# EAGLE design MyoWare_Proto_Shield (EAGLE 7.3.2)
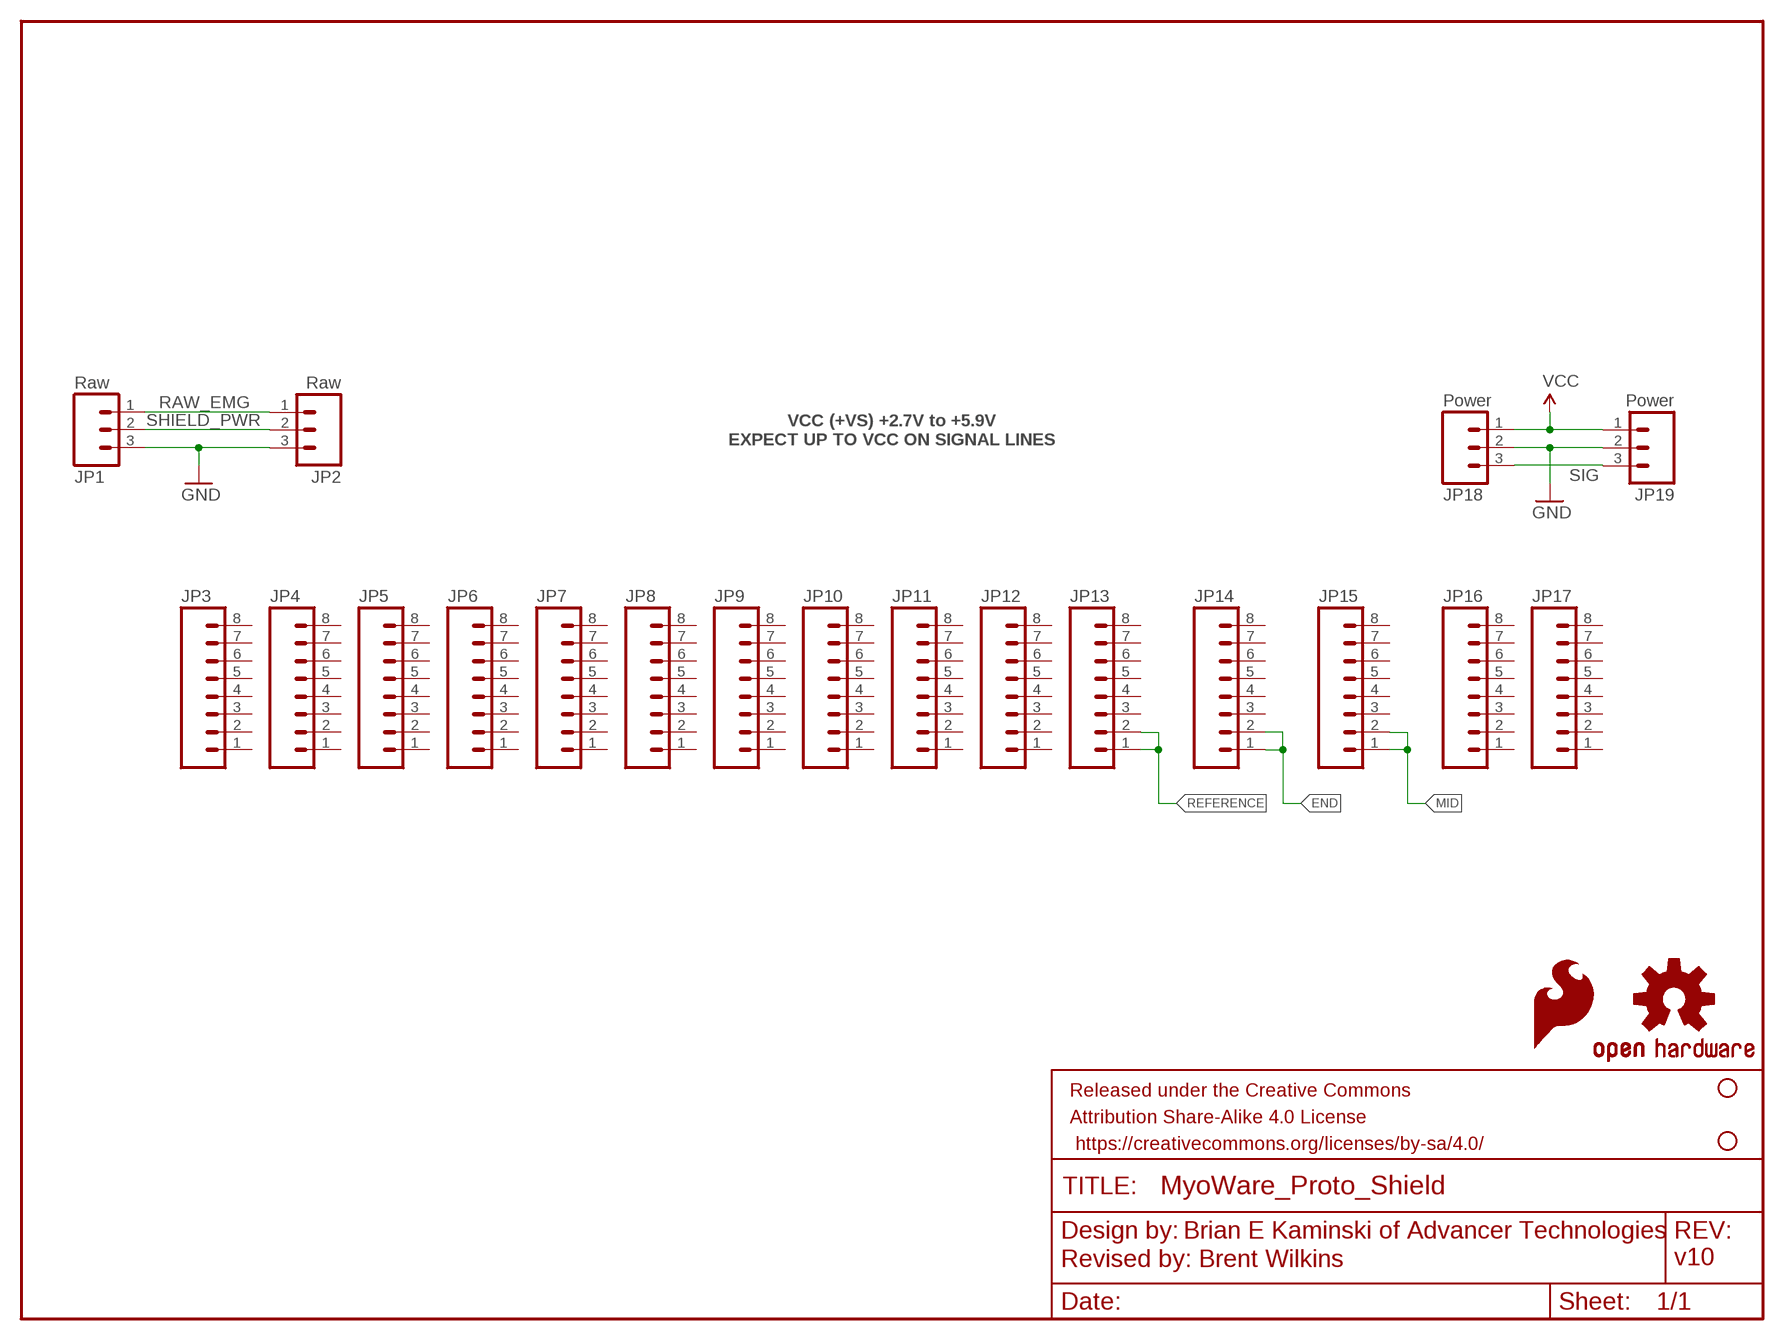
[diagram p0: schematic, sheet 1]

## Parts
FRAME1  FRAME-LETTER  [CREATIVE_COMMONS]
JP1  Raw  M031X03_NO_SILK  [1X03_NO_SILK]
JP2  Raw  M031X03_NO_SILK  [1X03_NO_SILK]
JP3  M08NO_SILK  [1X08_NO_SILK]
JP4  M08NO_SILK  [1X08_NO_SILK]
JP5  M08NO_SILK  [1X08_NO_SILK]
JP6  M08NO_SILK  [1X08_NO_SILK]
JP7  M08NO_SILK  [1X08_NO_SILK]
JP8  M08NO_SILK  [1X08_NO_SILK]
JP9  M08NO_SILK  [1X08_NO_SILK]
JP10  M08NO_SILK  [1X08_NO_SILK]
JP11  M08NO_SILK  [1X08_NO_SILK]
JP12  M08NO_SILK  [1X08_NO_SILK]
JP13  M08NO_SILK  [1X08_NO_SILK]
JP14  M08NO_SILK  [1X08_NO_SILK]
JP15  M08NO_SILK  [1X08_NO_SILK]
JP16  M08NO_SILK  [1X08_NO_SILK]
JP17  M08NO_SILK  [1X08_NO_SILK]
JP18  Power  M031X03_NO_SILK  [1X03_NO_SILK]
JP19  Power  M031X03_NO_SILK  [1X03_NO_SILK]
JP20  STAND-OFF  [STAND-OFF]
JP21  STAND-OFF  [STAND-OFF]
LOGO1  SFE_LOGO_FLAME.1_INCH  [SFE_LOGO_FLAME_.1]
LOGO2  OSHW-LOGOS  [OSHW-LOGO-S]

## Nets
END: JP14.1 JP14.2
GND: JP1.3 JP2.3 JP18.2 JP19.2
MID: JP15.1 JP15.2
RAW_EMG: JP1.1 JP2.1
REFERENCE: JP13.1 JP13.2
SHIELD_PWR: JP1.2 JP2.2
SIG: JP18.3 JP19.3
VCC: JP18.1 JP19.1
Unconnected: JP3.1 JP3.2 JP3.3 JP3.4 JP3.5 JP3.6 JP3.7 JP3.8 JP4.1 JP4.2 JP4.3 JP4.4 JP4.5 JP4.6 JP4.7 JP4.8 JP5.1 JP5.2 JP5.3 JP5.4 JP5.5 JP5.6 JP5.7 JP5.8 JP6.1 JP6.2 JP6.3 JP6.4 JP6.5 JP6.6 JP6.7 JP6.8 JP7.1 JP7.2 JP7.3 JP7.4 JP7.5 JP7.6 JP7.7 JP7.8 JP8.1 JP8.2 JP8.3 JP8.4 JP8.5 JP8.6 JP8.7 JP8.8 JP9.1 JP9.2 JP9.3 JP9.4 JP9.5 JP9.6 JP9.7 JP9.8 JP10.1 JP10.2 JP10.3 JP10.4 JP10.5 JP10.6 JP10.7 JP10.8 JP11.1 JP11.2 JP11.3 JP11.4 JP11.5 JP11.6 JP11.7 JP11.8 JP12.1 JP12.2 JP12.3 JP12.4 JP12.5 JP12.6 JP12.7 JP12.8 JP13.3 JP13.4 JP13.5 JP13.6 JP13.7 JP13.8 JP14.3 JP14.4 JP14.5 JP14.6 JP14.7 JP14.8 JP15.3 JP15.4 JP15.5 JP15.6 JP15.7 JP15.8 JP16.1 JP16.2 JP16.3 JP16.4 JP16.5 JP16.6 JP16.7 JP16.8 JP17.1 JP17.2 JP17.3 JP17.4 JP17.5 JP17.6 JP17.7 JP17.8

## Notes on the sheet
- VCC (+VS) +2.7V to +5.9V
  EXPECT UP TO VCC ON SIGNAL LINES
- Brian E Kaminski of Advancer Technologies
- Revised by: Brent Wilkins | v10

## Library data of the parts
FRAME1 = SparkFun-Aesthetics:FRAME-LETTER: Schematic Frame Standard 8.5x11 US Letter frame
JP1 JP2 JP18 JP19 = SparkFun-Connectors:M03: Header 3 Standard 3-pin 0.1" header. Use with straight break away headers (SKU : PRT-00116), right angle break away headers (PRT-00553), swiss pins (PRT-00743), machine pins (PRT-00117), and female headers (PRT-00115). Molex polarized connector foot print use with SKU : PRT-08232 with associated crimp pins and housings.
JP3-JP17 = SparkFun-Connectors:M08: Header 8 Standard 8-pin 0.1" header. Use with straight break away headers (SKU : PRT-00116), right angle break away headers (PRT-00553), swiss pins (PRT-00743), machine pins (PRT-00117), and female headers (PRT-00115).
JP20 JP21 = SparkFun-Electromechanical:STAND-OFF: #4 Stand Off This is the mechanical footprint for a #4 phillips button head screw. Use the keepout ring to avoid running the screw head into surrounding components. SKU : PRT-00447
LOGO1 = SparkFun-Aesthetics:SFE_LOGO_FLAME: SFE Logo, flame only This is the SparkFun flame logo. The logo on the schematic will always be the same size; the package variant is the height of the flame. Default layer for the logo on the board is tSilk.
LOGO2 = SparkFun-Aesthetics:OSHW-LOGO: Open Source Hardware Logo This logo indicates the piece of hardware it is found on incorporates a OSHW license and/or adheres to the definition of open source hardware found here: http://freedomdefined.org/OSHW

## Board
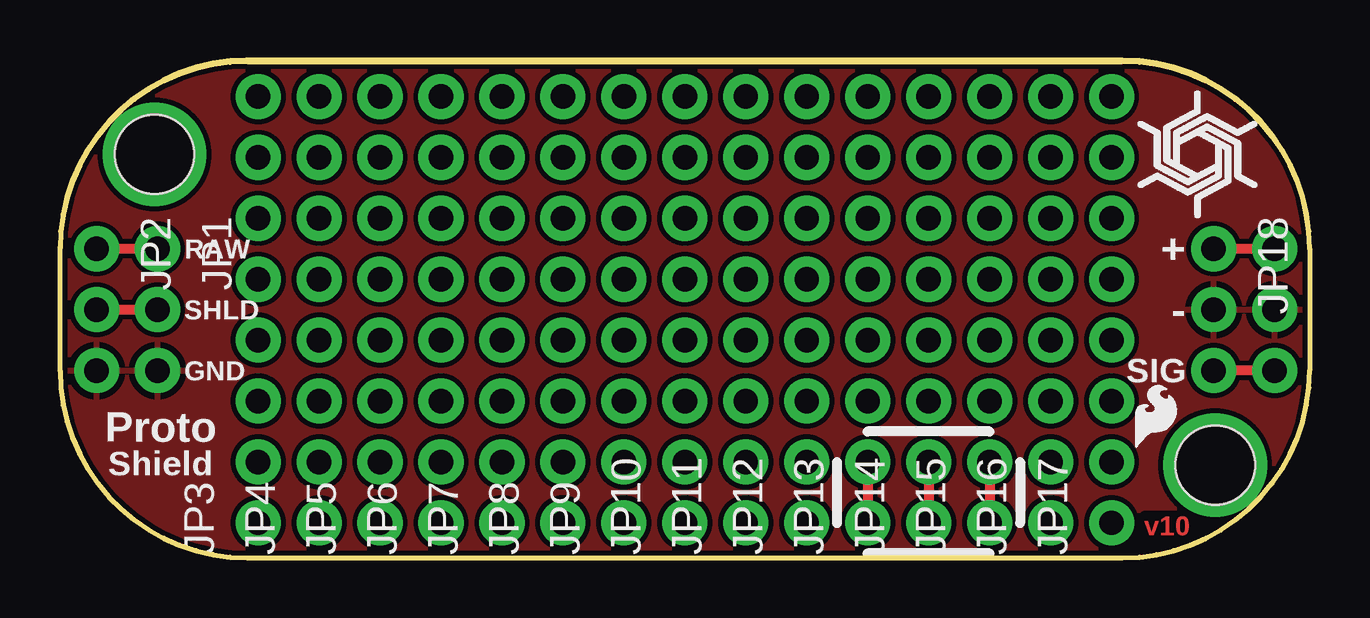
[diagram p1: board, top side]
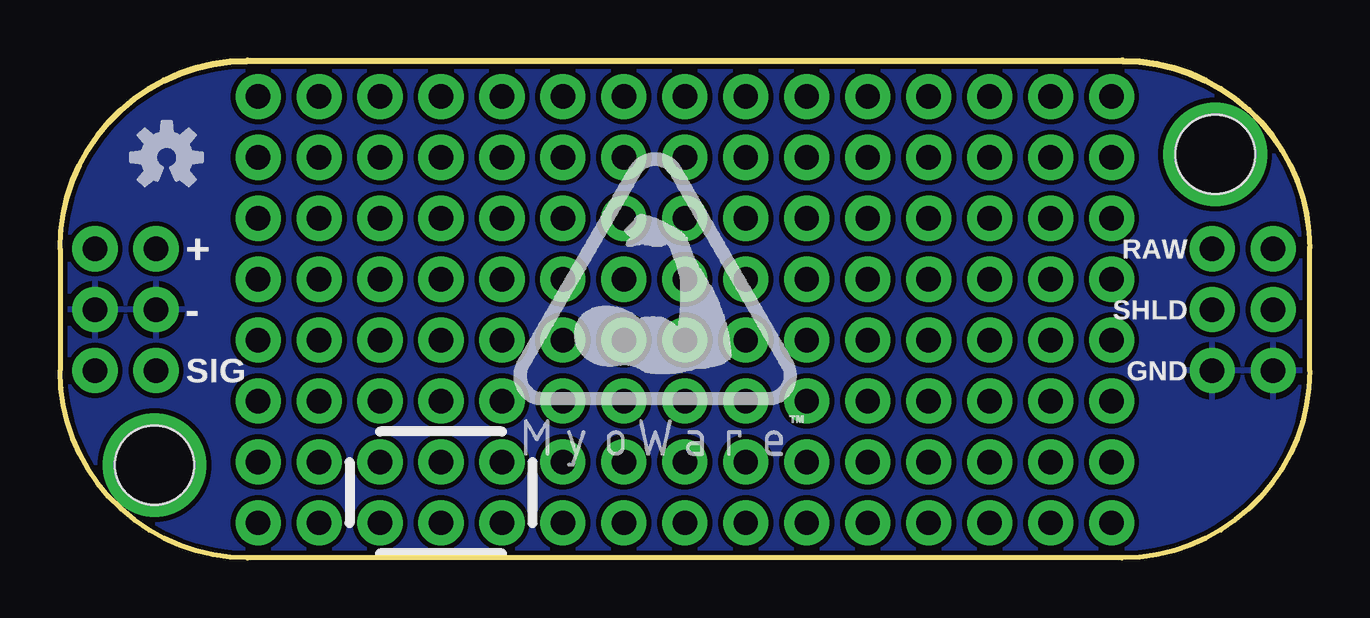
[diagram p2: board, bottom side, seen from below]

Size 52.07 x 20.76 mm. Coordinates in mm from the lower left corner, seen from the top.
Outline: 7.81,20.76 44.26,20.76 arc-90 52.07,12.89
Outline: 7.81,20.76 7.78,20.76 7.81,20.7
Outline: 7.81,20.76 arc90 0,12.89
Outline: 0,7.81 arc90 7.81,0
Outline: 44.26,0 arc90 52.07,7.81
Outline: 7.81,0 44.26,0
Outline: 0,7.81 0,12.89
Outline: 0,12.89 0,12.95
Outline: 7.81,20.7 arc90 0,12.89
Outline: 0,7.81 arc90 7.81,0
Outline: 52.07,12.89 52.07,7.81
Outline: 44.26,0 arc90 52.07,7.81
Outline: 52.07,12.89 arc90 44.26,20.7 7.81,20.7
Copper layers (1*16): Top 0.035mm / dielectric 1.5mm / Bottom 0.035mm
Design rules "Gold_Phoenix_Standard_Spec_2_layer": minimum track width 5mil, minimum drill 6mil, track to track 5mil, track to pad 5mil, pad to pad 5mil, via to via 5mil, smd to smd 5mil, copper to edge 8mil, drill to drill 8mil, minimum pad ring 5mil, minimum via ring 5mil, stop-mask expansion 4mil, vias tented up to drill 20mil, thermal gap 10mil

### Footprints (pad centres in the part's own frame; a part is rotated, then mirrored left to right if it is on the bottom)
1X03_NO_SILK = drill 1.016 pad 1.88: 1 0,0; 2 2.54,0; 3 5.08,0
1X08_NO_SILK = drill 1.016 pad 1.88: 1 0,0; 2 2.54,0; 3 5.08,0; 4 7.62,0; 5 10.16,0; 6 12.7,0; 7 15.24,0; 8 17.78,0
STAND-OFF = hole 3.302: 0,0

### Placement (x,y rotation side)
FRAME1  -6.99,-9.97 0 top  (outside the outline)
JP1  4.06,12.89 270 top
JP2  1.52,12.89 270 top
JP3  8.25,1.46 90 top
JP4  10.79,1.46 90 top
JP5  13.34,1.46 90 top
JP6  15.88,1.46 90 top
JP7  18.41,1.46 90 top
JP8  20.95,1.46 90 top
JP9  23.5,1.46 90 top
JP10  26.04,1.46 90 top
JP11  28.57,1.46 90 top
JP12  31.12,1.46 90 top
JP13  33.66,1.46 90 top
JP14  36.2,1.46 90 top
JP15  38.73,1.46 90 top
JP16  41.27,1.46 90 top
JP17  43.81,1.46 90 top
JP18  48.07,12.89 270 top
JP19  50.61,12.89 270 top
JP20  3.94,16.83 0 top
JP21  48.13,3.87 0 top
LOGO1  44.5,4.27 0 top
LOGO2  47.62,16.7 0 bottom
U$1  [MYOWARE_LOGO]  27.3,10.35 0 bottom
U$9  [SPIRAL_LOGO_60%]  47.43,16.83 0 top

### Tracks (layer width: path | path; a pad name or v marks a point on that pad's centre or on a via)
END
  Top 0.406: JP14.2 JP14.1
GND
  pour Top (isolate 0.203): -0.32,-0.76 52.83,-0.63 52.83,21.59 -0.32,21.46
  pour Bottom (isolate 0.203): -0.32,0 52.83,0 52.83,20.76 -0.32,20.76
MID
  Top 0.406: JP15.2 JP15.1
N$1  (via drill 3.3)
  other vias: 3.94,16.83
N$2  (via drill 3.3)
  other vias: 48.13,3.87
RAW_EMG
  Top 0.406: JP2.1 JP1.1
REFERENCE
  Top 0.406: JP13.2 JP13.1
SHIELD_PWR
  Top 0.406: JP2.2 JP1.2
SIG
  Top 0.406: JP19.3 JP18.3
VCC
  Top 0.406: JP18.1 JP19.1

### Text on the board
Top: v10
tPlace: RAW | + | SHLD | - | GND | SIG | Proto | Shield
bPlace: RAW | + | SHLD | - | GND | SIG
Measures: All units in inches | 0.13" diameter typical
tDocu: Brian E Kaminski of Advancer Technologies | Revised by: Brent Wilkins